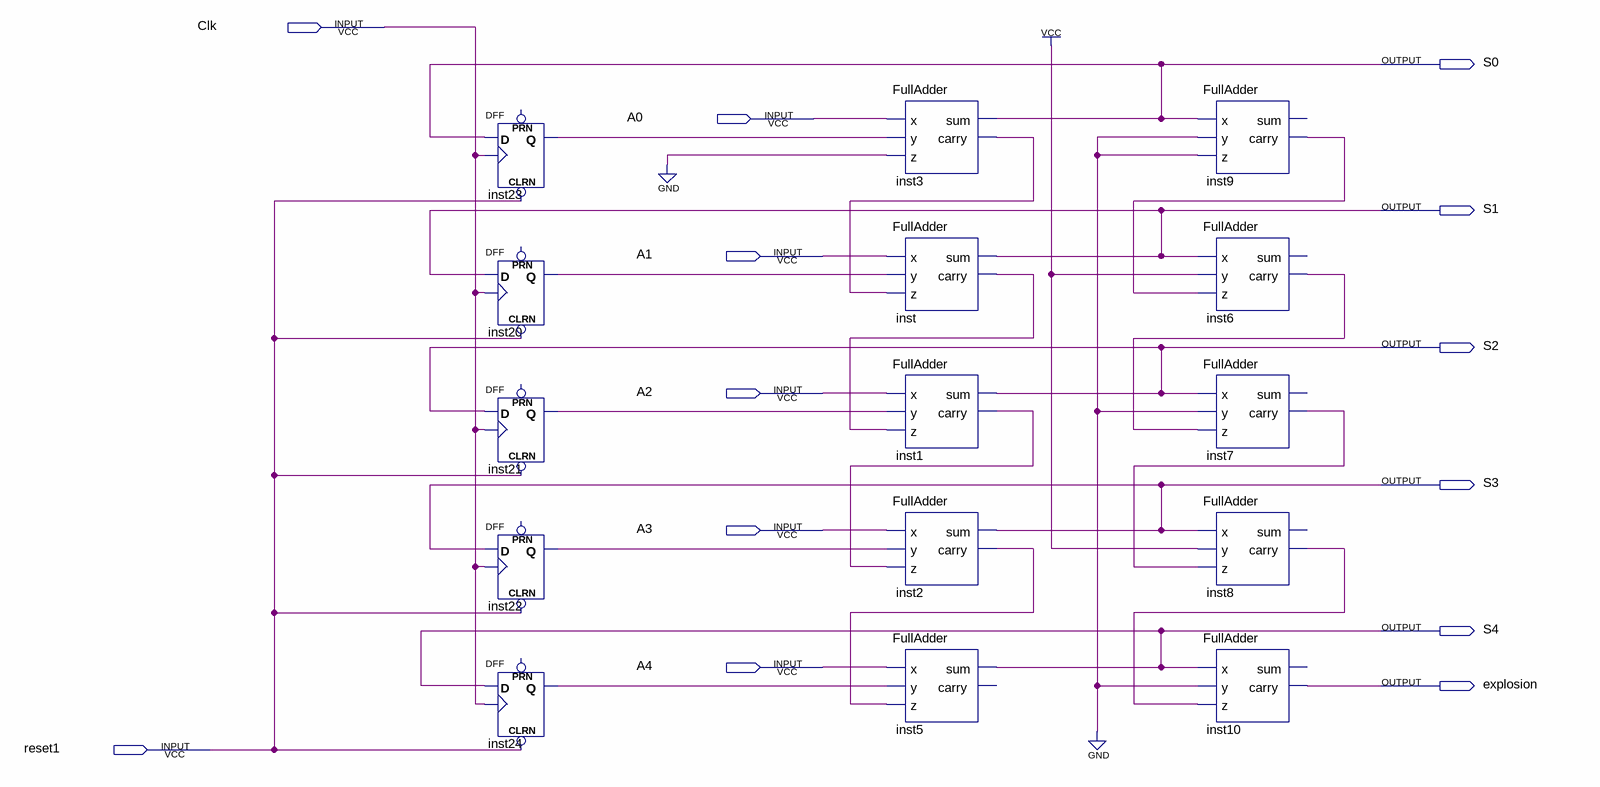
[diagram p0: schematic sheet]
// Quartus schematic final.bdf as structural Verilog: 15 symbols, 13 pins
module \final  (
  input  Clk,
  input  A0,
  input  A1,
  input  A2,
  input  A3,
  input  A4,
  input  reset1,
  output S0,
  output S1,
  output S2,
  output S3,
  output S4,
  output explosion
);

  wire inst1_carry, inst2_carry, inst3_carry, inst6_carry, inst7_carry, inst8_carry, inst9_carry, inst20_q,
       inst21_q, inst22_q, inst23_q, inst24_q, inst_carry;

  DFF inst23 (.CLRN(reset1), .CLK(Clk), .D(S0), .Q(inst23_q));  // open: PRN
  DFF inst20 (.CLRN(reset1), .CLK(Clk), .D(S1), .Q(inst20_q));  // open: PRN
  DFF inst21 (.CLRN(reset1), .CLK(Clk), .D(S2), .Q(inst21_q));  // open: PRN
  DFF inst22 (.CLRN(reset1), .CLK(Clk), .D(S3), .Q(inst22_q));  // open: PRN
  DFF inst24 (.CLRN(reset1), .CLK(Clk), .D(S4), .Q(inst24_q));  // open: PRN
  FullAdder inst3 (.x(A0), .y(inst23_q), .z(1'b0), .sum(S0), .carry(inst3_carry));
  FullAdder inst (.x(A1), .y(inst20_q), .z(inst3_carry), .sum(S1), .carry(inst_carry));
  FullAdder inst1 (.x(A2), .y(inst21_q), .z(inst_carry), .sum(S2), .carry(inst1_carry));
  FullAdder inst2 (.x(A3), .y(inst22_q), .z(inst1_carry), .sum(S3), .carry(inst2_carry));
  FullAdder inst5 (.x(A4), .y(inst24_q), .z(inst2_carry), .sum(S4));  // open: carry
  FullAdder inst9 (.x(S0), .y(1'b0), .z(1'b0), .carry(inst9_carry));  // open: sum
  FullAdder inst6 (.x(S1), .y(1'b1), .z(inst9_carry), .carry(inst6_carry));  // open: sum
  FullAdder inst7 (.x(S2), .y(1'b0), .z(inst6_carry), .carry(inst7_carry));  // open: sum
  FullAdder inst8 (.x(S3), .y(1'b1), .z(inst7_carry), .carry(inst8_carry));  // open: sum
  FullAdder inst10 (.x(S4), .y(1'b0), .z(inst8_carry), .carry(explosion));  // open: sum
endmodule
